# EAGLE design Carte Affichage (EAGLE 6.6.0)
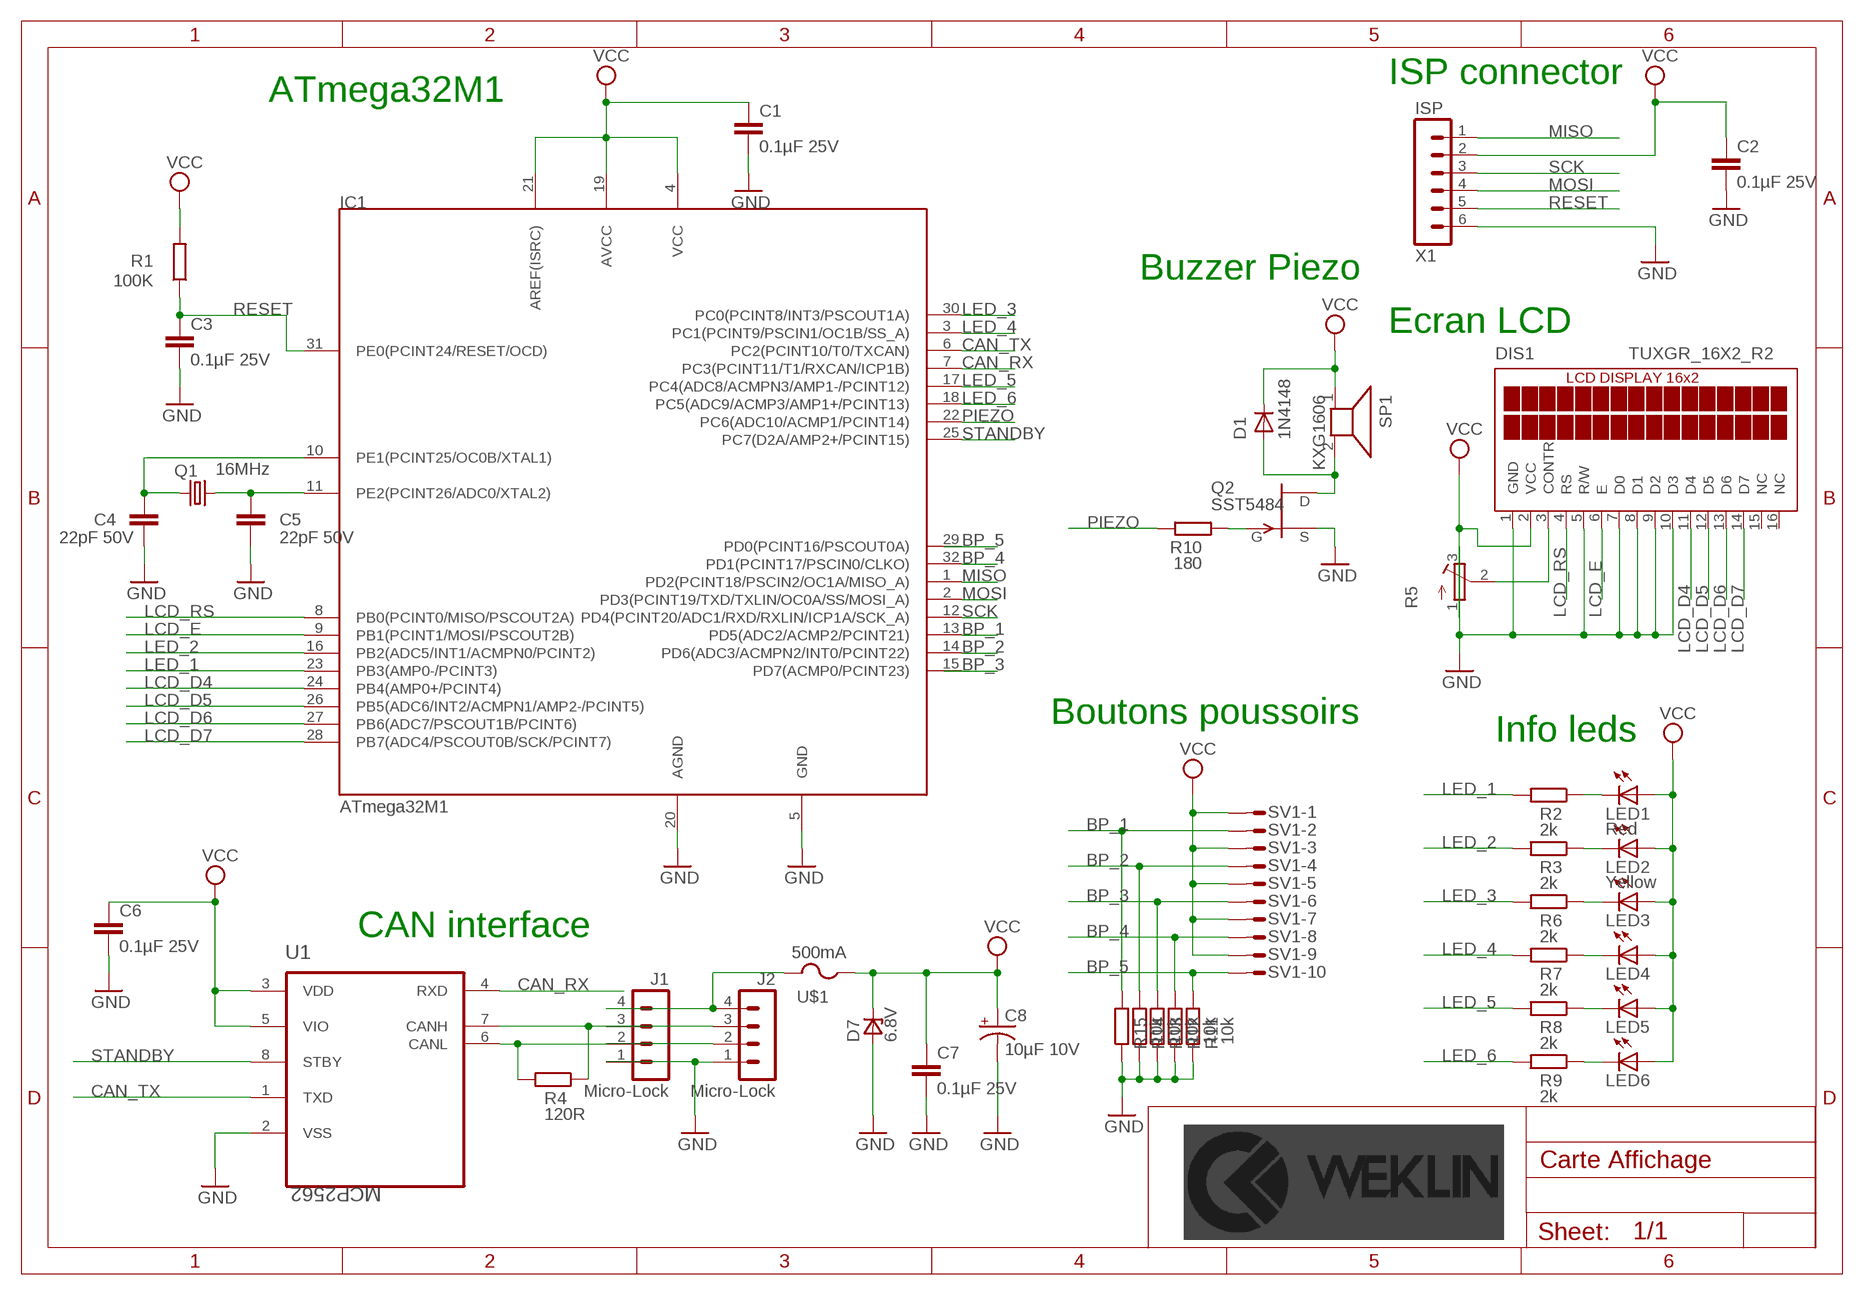
[diagram p0: schematic, sheet 1]

## Parts
C1  0.1µF 25V  CAPACITOR_NON_POL-0.1µF-25V(+-10%)(2012)  [C2012]
C2  0.1µF 25V  CAPACITOR_NON_POL-0.1µF-25V(+-10%)(2012)  [C2012]
C3  0.1µF 25V  CAPACITOR_NON_POL-0.1µF-25V(+-10%)(2012)  [C2012]
C4  22pF 50V  CAPACITOR_NON_POL-22PF-50V(+-5%)(2012)  [C2012]
C5  22pF 50V  CAPACITOR_NON_POL-22PF-50V(+-5%)(2012)  [C2012]
C6  0.1µF 25V  CAPACITOR_NON_POL-0.1µF-25V(+-10%)(2012)  [C2012]
C7  0.1µF 25V  CAPACITOR_NON_POL-0.1µF-25V(+-10%)(2012)  [C2012]
C8  10µF 10V  CAPACITOR_POL-10µF-10V(+-10%)(3216)  [EIA3216]
D1  1N4148  GF1  [SMA-DO214AC]
D7  6.8V  ZENER_UNIDIR6.8  [DO-214AA]
DIS1  TUXGR_16X2_R2  [TUXGR_16X2_R2]
IC1  ATmega32M1  ATMEGA32M1-TQFP32  [TQFP32]
J1  Micro-Lock  MICROLOCK-4CMS  [504195-0470]
J2  Micro-Lock  MICROLOCK-4CMS  [504195-0470]
LED1  Red  LEDVLDS1235G  [VLD]
LED2  Yellow  LED-VLDY1235G  [VLD]
LED3  LED5MM  [LED5MM]
LED4  LED5MM  [LED5MM]
LED5  LED5MM  [LED5MM]
LED6  LED5MM  [LED5MM]
Q1  16MHz  CRYSTAL-16MHZ_SMD(3225)  [SMD_KX7]
Q2  SST5484  [SOT23]
R1  100K  RESISTOR-100K(+-1%)(2012)  [R2012]
R2  2k  RESISTOR-1K1(+-1%)(2012)  [R2012]
R3  2k  RESISTOR-1K1(+-1%)(2012)  [R2012]
R4  120R  RESISTOR-120R(+-1%)(2012)  [R2012]
R5  R-TRIMM3299W  [RTRIM3299W]
R6  2k  RESISTOR-1K1(+-1%)(2012)  [R2012]
R7  2k  RESISTOR-1K1(+-1%)(2012)  [R2012]
R8  2k  RESISTOR-1K1(+-1%)(2012)  [R2012]
R9  2k  RESISTOR-1K1(+-1%)(2012)  [R2012]
R10  180  RESISTOR-1K1(+-1%)(2012)  [R2012]
R11  10k  RESISTOR-1K1(+-1%)(2012)  [R2012]
R12  10k  RESISTOR-1K1(+-1%)(2012)  [R2012]
R13  10k  RESISTOR-1K1(+-1%)(2012)  [R2012]
R14  10k  RESISTOR-1K1(+-1%)(2012)  [R2012]
R15  10k  RESISTOR-1K1(+-1%)(2012)  [R2012]
SP1  KXG1606  AL23P  [AL23P]
SV1  S10P  [S10P2]
U1  MCP2562  MCP2562-E/SN-SOIC8  [SOIC8]
U$1  500mA  FUSE  [EIARS-481-2]
X1  ISP  MINITEK_127_6WAYS-SMD  [MINITEK_127_6WAY_SMD]

## Nets
BP_1: IC1.13(PD5(ADC2/ACMP2/PCINT21)) R15.2 SV1.P$2
BP_2: IC1.14(PD6(ADC3/ACMPN2/INT0/PCINT22)) R14.2 SV1.P$4
BP_3: IC1.15(PD7(ACMP0/PCINT23)) R13.2 SV1.P$6
BP_4: IC1.32(PD1(PCINT17/PSCIN0/CLKO)) R12.2 SV1.P$8
BP_5: IC1.29(PD0(PCINT16/PSCOUT0A)) R11.2 SV1.P$10
CAN_RX: IC1.7(PC3(PCINT11/T1/RXCAN/ICP1B)) U1.4(RXD)
CAN_TX: IC1.6(PC2(PCINT10/T0/TXCAN)) U1.1(TXD)
GND: C1.2 C2.2 C3.2 C4.2 C5.2 C6.2 C7.2 C8.C(-) D7.A DIS1.1(GND) DIS1.5(R/W) DIS1.7(D0) DIS1.8(D1) DIS1.9(D2) DIS1.10(D3) IC1.5(GND) IC1.20(AGND) J1.1 J2.1 Q2.2(S) R5.3(A) R11.1 R12.1 R13.1 R14.1 R15.1 U1.2(VSS) X1.6
LCD_D4: DIS1.11(D4) IC1.24(PB4(AMP0+/PCINT4))
LCD_D5: DIS1.12(D5) IC1.26(PB5(ADC6/INT2/ACMPN1/AMP2-/PCINT5))
LCD_D6: DIS1.13(D6) IC1.27(PB6(ADC7/PSCOUT1B/PCINT6))
LCD_D7: DIS1.14(D7) IC1.28(PB7(ADC4/PSCOUT0B/SCK/PCINT7))
LCD_E: DIS1.6(E) IC1.9(PB1(PCINT1/MOSI/PSCOUT2B))
LCD_RS: DIS1.4(RS) IC1.8(PB0(PCINT0/MISO/PSCOUT2A))
LED_1: IC1.23(PB3(AMP0-/PCINT3)) R2.2
LED_2: IC1.16(PB2(ADC5/INT1/ACMPN0/PCINT2)) R3.2
LED_3: IC1.30(PC0(PCINT8/INT3/PSCOUT1A)) R6.2
LED_4: IC1.3(PC1(PCINT9/PSCIN1/OC1B/SS_A)) R7.2
LED_5: IC1.17(PC4(ADC8/ACMPN3/AMP1-/PCINT12)) R8.2
LED_6: IC1.18(PC5(ADC9/ACMP3/AMP1+/PCINT13)) R9.2
MISO: IC1.1(PD2(PCINT18/PSCIN2/OC1A/MISO_A)) X1.1
MOSI: IC1.2(PD3(PCINT19/TXD/TXLIN/OC0A/SS/MOSI_A)) X1.4
N$1: LED3.K(C) R6.1
N$2: LED1.C R2.1
N$3: LED2.C R3.1
N$4: J1.4 J2.4 U$1.2
N$5: J1.2 J2.2 R4.2 U1.6(CANL)
N$6: J1.3 J2.3 R4.1 U1.7(CANH)
N$7: C5.1 IC1.11(PE2(PCINT26/ADC0/XTAL2)) Q1.3
N$8: LED4.K(C) R7.1
N$9: C4.1 IC1.10(PE1(PCINT25/OC0B/XTAL1)) Q1.1
N$10: Q2.3(G) R10.2
N$11: D1.A Q2.1(D) SP1.2
N$12: LED5.K(C) R8.1
N$13: DIS1.3(CONTR) R5.2(S)
N$14: LED6.K(C) R9.1
PIEZO: IC1.22(PC6(ADC10/ACMP1/PCINT14)) R10.1
RESET: C3.1 IC1.31(PE0(PCINT24/RESET/OCD)) R1.1 X1.5
SCK: IC1.12(PD4(PCINT20/ADC1/RXD/RXLIN/ICP1A/SCK_A)) X1.3
STANDBY: IC1.25(PC7(D2A/AMP2+/PCINT15)) U1.8(STBY)
VCC: C1.1 C2.1 C6.1 C7.1 C8.A(+) D1.K(C) D7.C DIS1.2(VCC) IC1.4(VCC) IC1.19(AVCC) IC1.21(AREF(ISRC)) LED1.A LED2.A LED3.A LED4.A LED5.A LED6.A R1.2 R5.1(E) SP1.1 SV1.P$1 SV1.P$3 SV1.P$5 SV1.P$7 SV1.P$9 U1.3(VDD) U1.5(VIO) U$1.1 X1.2
Unconnected: DIS1.15(NC) DIS1.16(NC)

## Notes on the sheet
- ISP connector
- ATmega32M1
- Buzzer Piezo
- Ecran LCD
- Boutons poussoirs
- Info leds
- CAN interface

## Library data of the parts
C1-C3 C6 C7 = weklin_capacitor:CAPACITOR_NON_POL: Condensateur céramique multicouche; LIB: weklin_capacitor; MANUFACTURER: AVX; MPN: 08053C104KAT2A; OC_FARNELL: 2280951; PRICE: 0,0036
C4 C5 = weklin_capacitor:CAPACITOR_NON_POL: Condensateur céramique multicouche; LIB: weklin_capacitor; MANUFACTURER: Multicomp; MPN: MC0805N220J500CT; OC_FARNELL: 2310684; PRICE: 0,0078
C8 = weklin_capacitor:CAPACITOR_POL: Capacitor; LIB: weklin_capacitor; MANUFACTURER: Kemet; MPN: T491A106K010AT; OC_FARNELL: 2250086; PRICE: 0,0578
D1 = diode:GF1: DIODE
D7 = weklin_diode:ZENER_UNIDIR: P6SMBxxA Series of unidirectional Transient Voltage Suppressor Diodes xx = Stand-off Voltage VR in Volts; PPmax = 600 W Case: SMB = DO 214 AA Note: Footprint acc. to ST specs; source: www.st.com Author: Dipl.-Ing. FH Rainer Bayer, www.ing-rb.de/hhn Feedback: rainer.bayer@hs-heilbronn.de; LIB: weklin_diode; MANUFACTURER: ON Semiconductor; MPN: P6SMB6.8AT3G; OC_FARNELL: 1459166RL; PRICE: 0,178
DIS1 = display-lcd:TUXGR_16X2_R2: Tuxgraphics LCD display 16x2 characters reflective, without background light Source: tuxgr_12x2_r2.pdf; OC_FARNELL: unknown; OC_NEWARK: unknown
IC1 = weklin_micro-atmell:ATMEGA32M1: ATMEL ATMEGA32M1-AU MCU 8 BITS ATMEGA 16MHZ; LIB: weklin_micro_atmell; MANUFACTURER: Atmel; MPN: ATmega32M1-AU; OC_FARNELL: 2443180; PRICE: 6,18
J1 J2 = weklin_micro-lock:MICROLOCK-4: Connecteur MOLEX de 4 Contacts Série Mini50 GEII/IUT ANGERS; LIB: weklin_micro-lock; MANUFACTURER: Molex; MPN: 504195-0470; OC_FARNELL: 2445490; PRICE: 0,713
LED1 = weklin_led:LED: Led; LIB: weklin_led; MANUFACTURER: Vishay; MPN: VLDS1235G; OC_FARNELL: 2494682; PRICE: 0,003
LED2 = weklin_led:LED: Led; LIB: weklin_led; MANUFACTURER: Vishay; MPN: VLDY1235G; OC_FARNELL: 2494684; PRICE: 0,003
LED3-LED6 = led:LED: LED OSRAM: - CHIPLED LG R971, LG N971, LY N971, LG Q971, LY Q971, LO R971, LY R971 LH N974, LH R974 LS Q976, LO Q976, LY Q976 LO Q996 - Hyper CHIPLED LW Q18S LB Q993, LB Q99A, LB R99A - SideLED LS A670, LO A670, LY A670, LG A670, LP A670 LB A673, LV A673, LT A673, LW A673 LH A674 LY A675 LS A676, LA A676, LO A676, LY A676, LW A676 LS A679, LY A679, LG A679 - Hyper Micro SIDELED® LS Y876, LA Y876, LO Y876, LY Y876 LT Y87S - SmartLED LW L88C, LW L88S LB L89C, LB L89S, LG L890 LS L89K, LO L89K, LY L89K LS L896, LA L896, LO L896, LY L896 - TOPLED LS T670, LO T670, LY T670, LG T670, LP T670 LSG T670, LSP T670, LSY T670, LOP T670, LYG T670 LG T671, LOG T671, LSG T671 LB T673, LV T673, LT T673, LW T673 LH T674 LS T676, LA T676, LO T676, LY T676, LB T676, LH T676, LSB T676, LW T676 LB T67C, LV T67C, LT T67C, LS T67K, LO T67K, LY T67K, LW E67C LS E67B, LA E67B, LO E67B, LY E67B, LB E67C, LV E67C, LT E67C LW T67C LS T679, LY T679, LG T679 LS T770, LO T770, LY T770, LG T770, LP T770 LB T773, LV T773, LT T773, LW T773 LH T774 LS E675, LA E675, LY E675, LS T675 LS T776, LA T776, LO T776, LY T776, LB T776 LHGB T686 LT T68C, LB T68C - Hyper Mini TOPLED® LB M676 - Mini TOPLED Santana® LG M470 LS M47K, LO M47K, LY M47K Source: http://www.osram.convergy.de LUXEON: - LUMILED® LXK2-PW12-R00, LXK2-PW12-S00, LXK2-PW14-U00, LXK2-PW14-V00 LXK2-PM12-R00, LXK2-PM12-S00, LXK2-PM14-U00 LXK2-PE12-Q00, LXK2-PE12-R00, LXK2-PE12-S00, LXK2-PE14-T00, LXK2-PE14-U00 LXK2-PB12-K00, LXK2-PB12-L00, LXK2-PB12-M00, LXK2-PB14-N00, LXK2-PB14-P00, LXK2-PB14-Q00 LXK2-PR12-L00, LXK2-PR12-M00, LXK2-PR14-Q00, LXK2-PR14-R00 LXK2-PD12-Q00, LXK2-PD12-R00, LXK2-PD12-S00 LXK2-PH12-R00, LXK2-PH12-S00 LXK2-PL12-P00, LXK2-PL12-Q00, LXK2-PL12-R00 Source: www.luxeon.com KINGBRIGHT: KA-3528ASYC Source: www.kingbright.com
Q1 = weklin_crystal:CRYSTAL: Crystal resonator; LIB: weklin_crystal; MANUFACTURER: AEL CRYSTALS; MPN: E3SB16.0000F09G11AE; OC_FARNELL: 2467444RL; PRICE: 0,315
Q2 = transistor-fet:?548*: N-Channel JFETs Source: VISHAY 2N5484.pdf Compatible: TO92 2N5245 J304 J305 U310 J308 J309 J310 TO72 2N4416 2N4416A 2N3823 2N4351 3N169 3N170 3N171 MFE3002 TO18 2N3796 2N3797 MFE825 Source: Motorola European Master Guide Pacge 3-59
R1 = weklin_resistor:RESISTOR: Resistor; LIB: weklin_resistor; MANUFACTURER: Multicomp; MPN: MCWR08X1003FTL; OC_FARNELL: 2446868; PRICE: 0,0014
R2 R3 R6-R15 = weklin_resistor:RESISTOR: Resistor; LIB: weklin_resistor; MANUFACTURER: Multicomp; MPN: MC0805S8F1101T5E; OC_FARNELL: 1635316; PRICE: 0,003; VALUE: 1K1
R4 = weklin_resistor:RESISTOR: Resistor; LIB: weklin_resistor; MANUFACTURER: Multicomp; MPN: MCWR08X1200FTL; OC_FARNELL: 2446878; PRICE: 0,0014
R5 = resistor:R-TRIMM: Trimm resistor
SP1 = buzzer:AL23P: SPEAKER Source: Buerklin; OC_FARNELL: unknown; OC_NEWARK: unknown
SV1 = con-amp-mt:S10P: AMP MT CONNECTOR
U1 = weklin_ic_can:MCP2562-E/SN: High-Speed CAN Transceiver; LIB: weklin_ic_can; MANUFACTURER: Microchip; MPN: MCP2562-E/SN; OC_FARNELL: 2362839; PRICE: 1,12
U$1 = weklin_fuse:FUSE: Fuse 500mA 125V ultra fast; LIB: weklin_fuse; MANUFACTURER: Littlefuse; MPN: 0451.500MRL; OC_FARNELL: 2383271; PRICE: 0,527
X1 = weklin_connector:MINITEK_127_6WAYS: Board-To-Board Connector, Micro-MaTch Series, Embase, 6voies.; LIB: weklin_connector; MANUFACTURER: Minitek; MPN: 20021121-00006C4LF; OC_FARNELL: 1865277; PRICE: 0,333

## Board
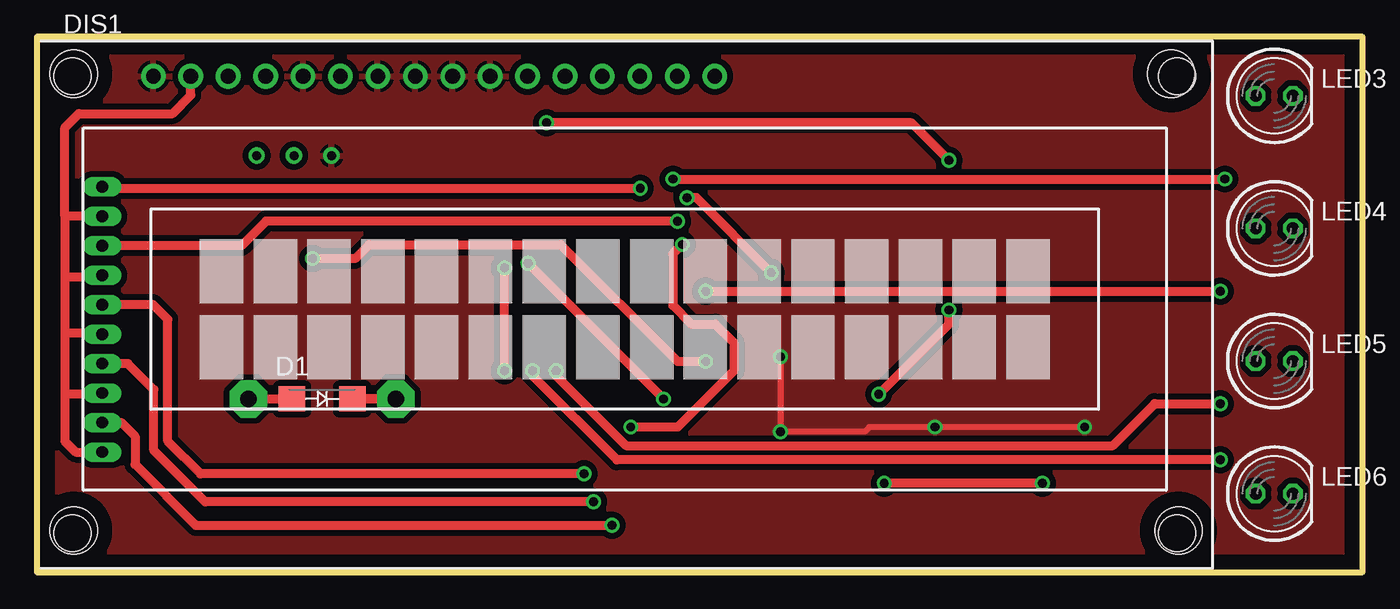
[diagram p1: board, top side]
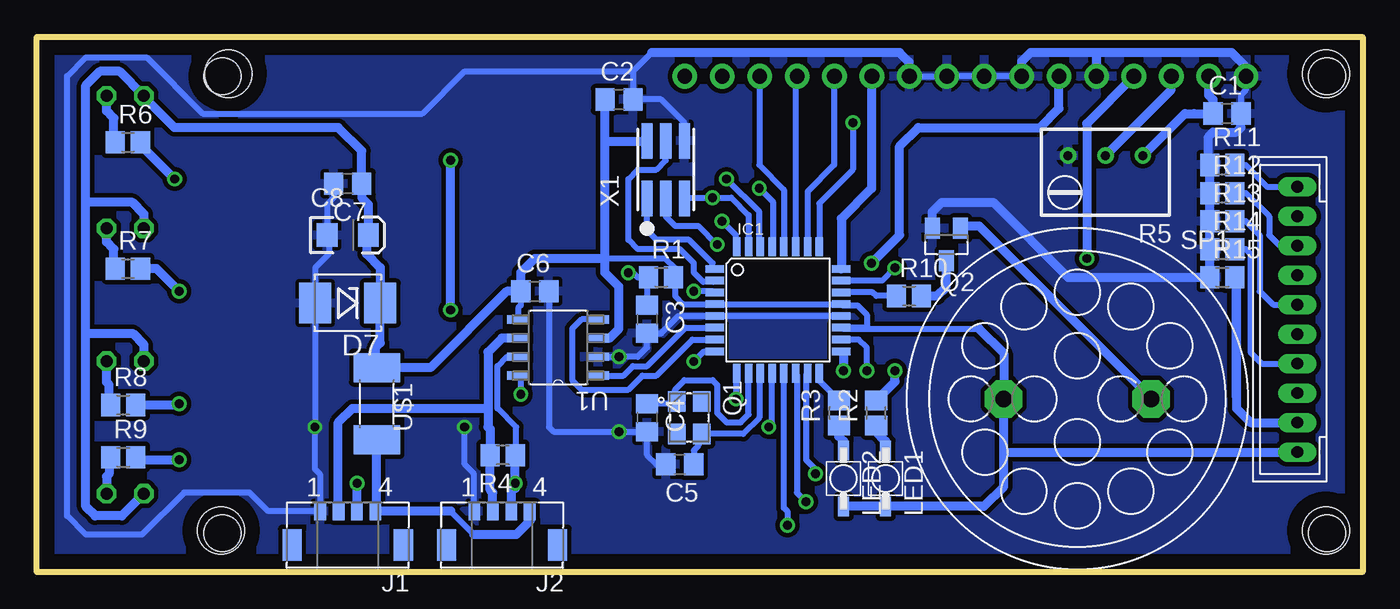
[diagram p2: board, bottom side, seen from below]

Size 90 x 36.32 mm. Coordinates in mm from the lower left corner, seen from the top.
Outline: 0,0 90,0 90,36.32 0,36.32 0,0
Copper layers (1*16): Top 0.035mm / dielectric 1.5mm / Bottom 0.035mm
Design rules "default": minimum track width 10mil, minimum drill 24mil, track to track 8mil, track to pad 8mil, pad to pad 8mil, via to via 8mil, smd to smd 8mil, copper to edge 40mil, drill to drill 8mil, minimum pad ring 10mil, minimum via ring 8mil, stop-mask expansion 4mil, vias tented up to drill 0mil, thermal gap 10mil
Holes 3.2 mm at 2.5,2.82 77.5,2.82 2.5,33.82 77,33.82

### Footprints (pad centres in the part's own frame; a part is rotated, then mirrored left to right if it is on the bottom)
C2012 = smd 1.3 x 1.5: 1 -0.95,0; 2 0.95,0
EIA3216 = smd 1.4 x 1.6: A 1.4,0; C -1.4,0
SMA-DO214AC = smd 1.8 x 1.7: A -2.05,0; K 2.05,0
DO-214AA = smd 2.159 x 2.743: A 2.21,0; C -2.21,0
TUXGR_16X2_R2 = drill 1 pad 1.676: 1 -32,15.5; 2 -29.46,15.5; 3 -26.92,15.5; 4 -24.38,15.5; 5 -21.84,15.5; 6 -19.3,15.5; 7 -16.76,15.5; 8 -14.22,15.5; 9 -11.68,15.5; 10 -9.14,15.5; 11 -6.6,15.5; 12 -4.06,15.5; 13 -1.52,15.5; 14 1.02,15.5; 15 3.56,15.5; 16 6.1,15.5 | hole 2.5: -37.5,-15.5; 37.5,-15.5; -37.5,15.5; 37.5,15.5
TQFP32 = smd 1.27 x 0.508: 1 -4.293,2.8; 2 -4.293,2; 3 -4.293,1.2; 4 -4.293,0.4; 5 -4.293,-0.4; 6 -4.293,-1.2; 7 -4.293,-2; 8 -4.293,-2.8; 17 4.293,-2.8; 18 4.293,-2; 19 4.293,-1.2; 20 4.293,-0.4; 21 4.293,0.4; 22 4.293,1.2; 23 4.293,2; 24 4.293,2.8 | smd 0.508 x 1.27: 9 -2.8,-4.293; 10 -2,-4.293; 11 -1.2,-4.293; 12 -0.4,-4.293; 13 0.4,-4.293; 14 1.2,-4.293; 15 2,-4.293; 16 2.8,-4.293; 25 2.8,4.293; 26 2,4.293; 27 1.2,4.293; 28 0.4,4.293; 29 -0.4,4.293; 30 -1.2,4.293; 31 -2,4.293; 32 -2.8,4.293
504195-0470 = smd 0.8 x 1.2: 1 1.875,0; 2 0.625,0; 3 -0.625,0; 4 -1.875,0 | smd 1.3 x 2.15: P$5 -3.775,2.295; P$6 3.775,2.295
VLD = smd 0.75 x 1.35: A 0,1.9; C 0,-1.9
LED5MM = drill 0.813 octagon: A -1.27,0; K 1.27,0
SMD_KX7 = smd 1.4 x 1.2: 1 -1.1,-0.85; 2 1.1,-0.85; 3 1.1,0.85; 4 -1.1,0.85
SOT23 = smd 1 x 1.4: 1 -0.95,-1.1; 2 0.95,-1.1; 3 0,1.1
R2012 = smd 1.3 x 1.5: 1 -0.85,0; 2 0.85,0
RTRIM3299W = drill 0.61: 1 1.27,-2.54; 2 1.27,0; 3 1.27,2.54
AL23P = drill 1.118 pad 2.54 octagon: 1 -5.004,0; 2 5.004,0
S10P2 = drill 0.8 long: P$1 -9,0; P$2 -7,0; P$3 -5,0; P$4 -3,0; P$5 -1,0; P$6 1,0; P$7 3,0; P$8 5,0; P$9 7,0; P$10 9,0
SOIC8 = smd 1.473 x 0.559: 1 -2.718,1.905; 2 -2.718,0.635; 3 -2.718,-0.635; 4 -2.718,-1.905; 5 2.718,-1.905; 6 2.718,-0.635; 7 2.718,0.635; 8 2.718,1.905
EIARS-481-2 = smd 1.956 x 3.15: 1 -2.451,0; 2 2.451,0
MINITEK_127_6WAY_SMD = smd 0.76 x 2.4: 1 -1.27,-1.95; 2 -1.27,1.95; 3 0,-1.95; 4 0,1.95; 5 1.27,-1.95; 6 1.27,1.95

### Placement (x,y rotation side)
C1  9.21,31.11 0 bottom
C2  50.48,32.07 0 bottom
C3  48.58,17.14 270 bottom
C4  48.58,10.48 270 bottom
C5  46.35,7.3 180 bottom
C6  56.2,19.05 0 bottom
C7  68.9,26.35 180 bottom
C8  68.9,22.86 0 bottom
D1  19.37,11.75 0 top
D7  68.9,18.25 180 bottom
DIS1  39.91,18.14 0 top
IC1  39.69,17.78 0 bottom
J1  68.9,4.13 180 bottom
J2  58.42,4.13 180 bottom
LED1  32.38,6.35 180 bottom
LED2  35.24,6.35 180 bottom
LED3  84,32.32 0 top
LED4  84,23.32 0 top
LED5  84,14.32 0 top
LED6  84,5.32 0 top
Q1  45.72,10.48 270 bottom
Q2  28.26,22.22 180 bottom
R1  47.62,20 0 bottom
R2  33.02,10.79 90 bottom
R3  35.56,10.79 90 bottom
R4  58.37,7.94 180 bottom
R5  17.46,26.99 90 bottom
R6  83.82,29.16 0 bottom
R7  83.82,20.59 0 bottom
R8  84.14,11.34 0 bottom
R9  84.14,7.79 0 bottom
R10  30.8,18.73 0 bottom
R11  9.53,27.62 0 bottom
R12  9.53,25.72 0 bottom
R13  9.53,23.81 0 bottom
R14  9.53,21.91 0 bottom
R15  9.53,20 0 bottom
SP1  19.37,11.75 0 bottom
SV1  4.45,17.14 90 bottom
U1  54.61,15.24 180 bottom
U$1  66.92,11.42 270 bottom
X1  47.31,27.3 0 bottom

### Tracks (layer width: path | path; a pad name or v marks a point on that pad's centre or on a via)
BP_1  (via drill 0.6)
  Top 0.61: SV1.P$2 4.46,10.16 5.71,10.16 6.67,9.21 6.67,7.3 10.79,3.17 37.78,3.17 v39.05,3.17
  Bottom 0.406: 8.68,11.85 R15.2 | IC1.13 39.29,4.36 39.05,4.13 v39.05,3.17
  Bottom 0.61: 4.46,10.16 SV1.P$2 7.61,10.15 8.57,11.11 8.57,19.9 R15.2
BP_2  (via drill 0.6)
  Top 0.61: v37.78,4.76 11.43,4.76 7.94,8.26 7.94,12.38 6.17,14.15 SV1.P$4
  Bottom 0.406: IC1.14 38.42,13.42 38.42,5.4 v37.78,4.76 | R14.2 7.94,21.91 7.62,21.59 7.62,14.92 6.84,14.15 SV1.P$4
BP_3  (via drill 0.6)
  Top 0.61: SV1.P$6 7.89,18.15 8.89,17.15 8.89,8.89 11.11,6.67 v37.15,6.67
  Bottom 0.406: IC1.15 37.78,13.39 37.78,7.62 37.15,6.99 v37.15,6.67 | R13.2 7.94,23.81 6.99,22.86 6.99,19.05 6.08,18.15 SV1.P$6
BP_4  (via drill 0.6)
  Top 0.61: v43.5,23.81 15.56,23.81 13.89,22.15 SV1.P$8
  Bottom 0.406: IC1.32 42.55,22.13 42.55,22.86 v43.5,23.81 | R12.2 7.94,25.72 6.35,24.13 6.35,22.86 5.63,22.15 SV1.P$8
BP_5  (via drill 0.6)
  Top 0.61: SV1.P$10 4.55,26.04 v40.96,26.04
  Bottom 0.406: IC1.29 40.01,22.16 40.01,25.08 v40.96,26.04 | R11.2 7.94,27.62 6.46,26.15 SV1.P$10
CAN_RX
  Bottom 0.406: U1.4 53.02,17.15 53.66,16.51 53.66,13.02 53.02,12.38 49.85,12.38 48.9,13.34 47.94,13.34 45.5,15.78 IC1.7
CAN_TX
  Bottom 0.406: U1.1 50.16,13.34 49.53,13.97 48.58,13.97 45.97,16.58 IC1.6
GND  (via drill 0.6)
  Top 0.406: v50.48,14.6 v50.48,9.53 56.2,9.53 56.52,9.84 v60.96,9.84 v71.12,9.84
  Bottom 0.406: X1.6 46.04,30.48 47.62,32.07 C2.2 49.53,33.97 | U1.2 v50.48,14.6 49.21,14.6 48.58,15.24 C3.2 47.62,16.19 46.44,17.38 IC1.5 IC1.20 | C7.2 69.85,25.4 70.3,24.95 C8.C 70.17,22.73 70.17,21.59 71.11,20.65 D7.A 71.12,18.24 v71.12,9.84 71.12,6.99 70.77,6.64 J1.1 74.3,4.13 75.56,5.4 80.01,5.4 82.87,2.54 86.68,2.54 87.95,3.81 87.95,33.65 86.68,34.93 82.55,34.93 78.74,31.11 63.82,31.11 60.96,33.97 49.53,33.97 | 18.1,33.61 DIS1.5 18.1,33.66 18.1,35.24 18.07,35.22 | DIS1.1 7.94,33.61 7.94,32.7 8.26,32.39 | 8.26,32.39 8.26,32.38 C1.2 8.26,32.39 | DIS1.7 DIS1.8 DIS1.9 DIS1.10 30.8,33.66 | C5.2 47.94,7.3 48.58,7.94 C4.2 v50.48,9.53 54.93,9.53 55.24,9.84 C6.2 | 48.26,35.24 49.53,33.97 | J2.1 60.33,4.16 60.33,6.67 60.96,7.3 v60.96,9.84
  Bottom 0.61: 7.94,33.61 7.94,34.29 8.89,35.24 18.1,35.24 22.54,35.24 23.15,34.64 DIS1.7 | 18.07,35.22 DIS1.5 | 30.8,33.66 30.8,34.61 31.43,35.24 48.26,35.24 | C1.2 8.26,30.16 8.57,29.84 10.16,29.84 10.48,29.53 10.48,27.72 R11.1 R12.1 R13.1 R14.1 R15.1 20,20 25.08,25.08 28.57,25.08 29.21,24.45 Q2.2
  pour Top (isolate 0.406): 0,36.2 89.85,36.2 89.85,0 0,0
  pour Bottom (isolate 0.305): 0,36.2 89.85,36.2 89.85,0 0,0
LCD_D4
  Bottom 0.406: DIS1.11 33.34,33.61
  Bottom 0.61: 33.34,33.61 33.34,26.04 35.4,23.98 IC1.24
LCD_D5
  Bottom 0.406: DIS1.12 35.88,33.61 35.88,27.62 37.69,25.81 IC1.26
LCD_D6
  Bottom 0.406: DIS1.13 38.49,33.54 IC1.27
LCD_D7
  Bottom 0.406: DIS1.14 40.96,33.61 40.96,27.62 39.29,25.95 IC1.28
LCD_E  (via drill 0.6)
  Top 0.61: v42.55,11.75 v33.34,20.95
  Bottom 0.406: IC1.9 42.55,13.43 v42.55,11.75
  Bottom 0.61: v33.34,20.95 31.43,22.86 31.43,28.89 30.16,30.16 21.91,30.16 20.61,31.46 DIS1.6
LCD_RS  (via drill 0.6)
  Top 0.61: v45.4,14.29 43.5,14.29 35.56,22.22 22.54,22.22 21.59,21.27 v18.73,21.27
  Bottom 0.406: v45.4,14.29 44.71,14.98 IC1.8
  Bottom 0.61: DIS1.4 18.73,30.43 v18.73,21.27
LED_1  (via drill 0.6)
  Top 0.61: v31.75,13.65 v31.75,20.64
  Bottom 0.406: v31.75,20.64 32.61,19.78 IC1.23
  Bottom 0.61: v31.75,13.65 31.75,12.92 R2.2
LED_2
  Bottom 0.406: 36.83,13.43 IC1.16 36.89,12.97 R3.2
LED_3  (via drill 0.6)
  Top 0.61: v43.18,26.67 v80.64,26.67
  Bottom 0.406: IC1.30 40.96,22.14 40.96,24.45 v43.18,26.67 | 82.97,28.99 R6.2
  Bottom 0.61: v80.64,26.67 82.97,28.99
LED_4  (via drill 0.6)
  Top 0.61: v45.4,19.05 v80.33,19.05
  Bottom 0.406: IC1.3 44.05,19.05 v45.4,19.05
  Bottom 0.61: v80.33,19.05 81.87,20.59 R7.2
LED_5  (via drill 0.6)
  Top 0.61: v80.33,11.43 75.88,11.43 73.03,8.57 40.01,8.57 35.24,13.34 v35.24,13.65
  Bottom 0.406: IC1.17 35.24,14.83 | v80.33,11.43 80.42,11.34
  Bottom 0.61: 35.24,14.83 v35.24,13.65 | 80.42,11.34 R8.2
LED_6  (via drill 0.6)
  Top 0.61: v80.33,7.62 39.37,7.62 33.66,13.34 v33.66,13.65
  Bottom 0.406: R9.2 83.11,7.62 | v33.66,13.65 33.66,15.24 34.2,15.78 IC1.18
  Bottom 0.61: 83.11,7.62 v80.33,7.62
MISO
  Bottom 0.406: IC1.1 44.13,20.73 44.13,20.95 45.72,22.54 47.94,22.54 48.58,23.18 X1.1
MOSI
  Bottom 0.406: IC1.2 44.08,19.68 44.77,19.68 45.4,20.32 45.4,20.95 46.35,21.91 49.21,21.91 49.85,22.54 49.85,26.67 49.21,27.31 47.94,27.31 47.31,27.94 X1.4
N$1
  Bottom 0.406: R6.1 84.77,29.27
  Bottom 0.61: 84.77,29.27 84.77,30.8 85.27,31.29 LED3.K
N$2
  Bottom 0.61: LED1.C 32.38,8.89 33.02,9.52 R2.1
N$3
  Bottom 0.61: LED2.C 35.24,8.89 35.56,9.21 R3.1
N$4
  Bottom 0.406: J1.4 66.92,4.23 | J2.4 56.52,4.1 | 60.33,2.54 61.91,4.13
  Bottom 0.61: 66.92,4.23 U$1.2 | 56.52,4.1 56.52,3.49 57.47,2.54 60.33,2.54 | 61.91,4.13 J1.4
N$5
  Bottom 0.406: J2.2 | J1.2 69.53,4.14
  Bottom 0.61: J2.2 59.05,5.4 59.22,5.56 R4.2 59.22,9.69 59.37,9.84 59.37,11.11 | U1.6 58.42,15.87 59.37,14.92 59.37,11.11 | 69.53,4.14 69.53,10.16 68.58,11.11 59.37,11.11
N$6  (via drill 0.6)
  Top 0.61: v68.26,6.03 v57.52,6.03
  Bottom 0.406: J2.3 57.78,4.14 | 57.78,5.4 57.52,5.66 | R4.1 57.47,7.99 57.47,9.84 58.74,11.11 58.74,13.97 58.1,14.6 U1.7 | J1.3
  Bottom 0.61: 57.78,4.14 57.78,5.4 | 57.52,5.66 v57.52,6.03 R4.1 | J1.3 v68.26,6.03
N$7
  Bottom 0.406: C5.1 45.41,8.25 45.09,8.57 45.09,9.16 Q1.3 42.06,9.38 40.96,10.48 40.96,13.42 IC1.11
N$8
  Bottom 0.406: R7.1 84.77,20.69
  Bottom 0.61: 84.77,20.69 84.77,21.91 85.27,22.4 LED4.K
N$9
  Bottom 0.406: C4.1 46.72,11.43 Q1.1 46.67,11.68 46.67,12.38 46.04,13.02 44.13,13.02 43.81,12.7 43.81,10.79 43.18,10.16 42.23,10.16 41.69,10.7 IC1.10
N$10
  Bottom 0.61: R10.2 28.89,18.73 28.26,19.37 Q2.3
N$11
  Top 0.61: SP1.2 D1.A
  Bottom 0.61: Q2.1 27.14,23.49 26.04,23.49 14.36,11.82 SP1.2
N$12
  Bottom 0.406: R8.1 85.09,11.44
  Bottom 0.61: 85.09,11.44 85.09,12.7 85.27,12.88 LED5.K
N$13
  Bottom 0.61: 13.02,33.61 DIS1.3 12.99,32.73 R5.2
N$14
  Bottom 0.406: R9.1 85.09,7.69
  Bottom 0.61: 85.09,7.69 85.09,6.67 85.27,6.49 LED6.K
PIEZO
  Bottom 0.406: R10.1 33.02,18.73 33.27,18.98 IC1.22
RESET  (via drill 0.6)
  Top 0.61: v49.85,20.32 44.77,25.4 v44.13,25.4
  Bottom 0.406: 48.48,18.2 C3.1 48.58,19.9 R1.1 49.21,20 49.53,20.32 v49.85,20.32 | X1.5 45.99,25.4 v44.13,25.4 42.86,25.4 41.69,24.22 IC1.31
SCK  (via drill 0.6)
  Top 0.61: v43.81,22.22 43.18,21.59 43.18,18.1 44.45,16.83 46.04,16.83 47.31,15.56 47.31,13.65 43.5,9.84 v40.32,9.84
  Bottom 0.406: X1.3 47.31,24.13 46.67,23.49 45.09,23.49 v43.81,22.22 | v40.32,9.84 40.09,10.08 IC1.12
STANDBY  (via drill 0.6)
  Top 0.61: v57.15,12.07 61.91,16.83 v61.91,17.78 | v61.91,27.94 59.37,30.48 v34.61,30.48
  Bottom 0.406: U1.8 57.15,13.16 v57.15,12.07 | v34.61,30.48 34.61,27.31 36.89,25.02 IC1.25
  Bottom 0.61: v61.91,17.78 v61.91,27.94
VCC
  Top 0.61: DIS1.2 10.45,32.36 9.21,31.11 2.86,31.11 1.91,30.16 1.91,24.13 | SP1.1 D1.K 24.45,11.75 | SV1.P$9 4.43,24.13 1.91,24.13 | 1.91,24.13 1.91,20 | 1.91,20 1.91,16.19 | 1.91,16.19 1.91,12.07 | 1.91,12.07 1.91,8.89 2.65,8.14 SV1.P$1 | SV1.P$3 4.37,12.07 1.91,12.07 | SV1.P$5 4.4,16.19 1.91,16.19 | SV1.P$7 4.3,20 1.91,20
  Bottom 0.406: C6.1 57.15,18.1 57.33,17.92 U1.5 | X1.2 48.62,29.21 | R1.2 46.67,20.11 | 46.67,20.11 46.67,20.64 47.31,21.27 51.43,21.27 51.43,20.32 51.44,20.32 | 46.67,20.11 46.67,18.73 46.12,18.18 IC1.4 IC1.21 35.31,18.1 34.29,18.1 33.66,17.46 33.66,16.51 33.73,16.58 IC1.19 35.33,16.51 26.04,16.51 | U$1.1 66.99,13.94 | C8.A 67.63,22.73 | D7.C 66.53,18.1 | C7.1 | 10.48,33.61 DIS1.2 10.45,32.36 10.48,32.39 | C1.1 | 82.73,32.25 LED3.A
  Bottom 0.61: 48.62,29.21 51.43,29.21 | 51.43,21.27 51.43,29.21 | 51.43,29.21 C2.1 | 51.43,20.32 50.48,19.37 50.48,16.51 51.12,15.87 U1.3 | 51.44,20.32 51.44,21.27 56.2,21.27 57.15,20.32 C6.1 58.1,19.05 63.28,13.87 U$1.1 | 66.99,13.94 66.99,15.24 66.69,15.54 D7.C 66.69,20.65 67.63,21.59 67.63,22.73 | C8.A 67.5,24.95 67.94,25.4 C7.1 67.94,28.58 69.53,30.16 80.64,30.16 82.73,32.25 | LED3.A 84.39,33.97 85.72,33.97 86.68,33.02 86.68,25.08 | LED4.A 82.73,24.31 83.5,25.08 86.68,25.08 | LED6.A 84.24,3.81 86.04,3.81 86.68,4.45 86.68,16.19 | 86.68,16.19 86.68,25.08 | 86.68,16.19 83.5,16.19 82.73,15.42 LED5.A | 10.48,33.61 10.48,32.39 | 10.45,32.36 10.16,32.06 C1.1 | 11.43,31.11 C1.1 | R5.1 12.06,31.11 C1.1 | 24.37,8.18 24.37,5.79 25.71,4.45 LED1.A LED2.A | 24.37,8.18 SP1.1 24.37,14.85 26.04,16.51 | SV1.P$1 24.34,8.14 24.37,8.18